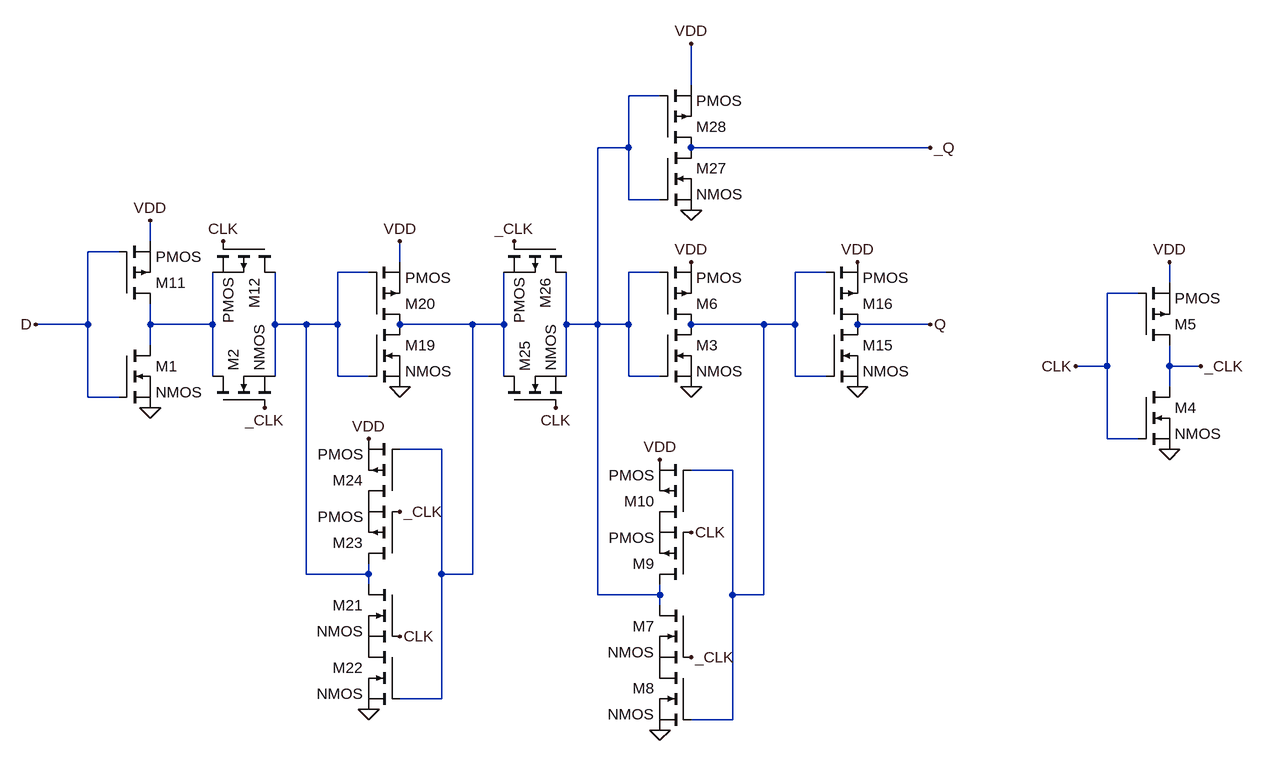
[diagram p0: schematic DFF.asc]
DFF.asc, the LTspice schematic file:
Version 4
SHEET 1 1504 1156
WIRE 656 -112 656 -176
WIRE 608 -96 560 -96
WIRE 560 -16 560 -96
WIRE 560 -16 512 -16
WIRE 1024 -16 656 -16
WIRE 560 64 560 -16
WIRE 608 64 560 64
WIRE -176 128 -176 96
WIRE -224 144 -272 144
WIRE 208 160 208 128
WIRE 160 176 112 176
WIRE 608 176 560 176
WIRE 864 176 816 176
WIRE 1392 192 1392 160
WIRE 1344 208 1296 208
WIRE -272 256 -272 144
WIRE -272 256 -352 256
WIRE -176 256 -176 224
WIRE -80 256 -80 176
WIRE -80 256 -176 256
WIRE 16 256 16 176
WIRE 64 256 16 256
WIRE 112 256 112 176
WIRE 112 256 64 256
WIRE 320 256 208 256
WIRE 368 256 368 176
WIRE 368 256 320 256
WIRE 464 256 464 176
WIRE 512 256 512 -16
WIRE 512 256 464 256
WIRE 560 256 560 176
WIRE 560 256 512 256
WIRE 768 256 656 256
WIRE 816 256 816 176
WIRE 816 256 768 256
WIRE 1024 256 912 256
WIRE -176 288 -176 256
WIRE 1296 320 1296 208
WIRE 1296 320 1248 320
WIRE 1392 320 1392 288
WIRE 1440 320 1392 320
WIRE -80 336 -80 256
WIRE 16 336 16 256
WIRE 112 336 112 256
WIRE 160 336 112 336
WIRE 368 336 368 256
WIRE 464 336 464 256
WIRE 560 336 560 256
WIRE 608 336 560 336
WIRE 816 336 816 256
WIRE 864 336 816 336
WIRE 1392 352 1392 320
WIRE -272 368 -272 256
WIRE -224 368 -272 368
WIRE 1296 432 1296 320
WIRE 1344 432 1296 432
WIRE 272 448 208 448
WIRE 720 480 656 480
WIRE 64 640 64 256
WIRE 160 640 160 624
WIRE 160 640 64 640
WIRE 272 640 272 448
WIRE 320 640 320 256
WIRE 320 640 272 640
WIRE 160 656 160 640
WIRE 512 672 512 256
WIRE 608 672 608 656
WIRE 608 672 512 672
WIRE 720 672 720 480
WIRE 768 672 768 256
WIRE 768 672 720 672
WIRE 608 688 608 672
WIRE 272 832 272 640
WIRE 272 832 208 832
WIRE 720 864 720 672
WIRE 720 864 656 864
FLAG -352 256 D
FLAG -176 384 0
FLAG 208 352 0
FLAG 160 848 0
FLAG 160 432 VDD
FLAG 656 80 0
FLAG 656 352 0
FLAG 608 880 0
FLAG 608 464 VDD
FLAG 912 352 0
FLAG -176 96 VDD
FLAG 208 128 VDD
FLAG 656 -176 VDD
FLAG 656 160 VDD
FLAG 912 160 VDD
FLAG -64 128 CLK
FLAG 448 384 CLK
FLAG 208 736 CLK
FLAG 656 768 _CLK
FLAG 0 384 _CLK
FLAG 384 128 _CLK
FLAG 208 544 _CLK
FLAG 656 576 CLK
FLAG 1024 -16 _Q
FLAG 1024 256 Q
FLAG 1392 448 0
FLAG 1392 160 VDD
FLAG 1248 320 CLK
FLAG 1440 320 _CLK
SYMBOL nmos -224 288 R0
SYMATTR InstName M1
SYMBOL nmos -80 384 R270
SYMATTR InstName M2
SYMBOL pmos -224 224 M180
SYMATTR InstName M11
SYMBOL pmos 16 128 R90
SYMATTR InstName M12
SYMBOL nmos 160 256 R0
SYMATTR InstName M19
SYMBOL pmos 160 256 M180
SYMATTR InstName M20
SYMBOL nmos 208 656 M0
SYMATTR InstName M21
SYMBOL nmos 208 752 M0
SYMATTR InstName M22
SYMBOL pmos 208 624 R180
SYMATTR InstName M23
SYMBOL pmos 208 528 R180
SYMATTR InstName M24
SYMBOL nmos 368 384 R270
SYMATTR InstName M25
SYMBOL pmos 464 128 R90
SYMATTR InstName M26
SYMBOL nmos 608 -16 R0
SYMATTR InstName M27
SYMBOL pmos 608 -16 M180
SYMATTR InstName M28
SYMBOL nmos 608 256 R0
SYMATTR InstName M3
SYMBOL pmos 608 256 M180
SYMATTR InstName M6
SYMBOL nmos 656 688 M0
SYMATTR InstName M7
SYMBOL nmos 656 784 M0
SYMATTR InstName M8
SYMBOL pmos 656 656 R180
SYMATTR InstName M9
SYMBOL pmos 656 560 R180
SYMATTR InstName M10
SYMBOL nmos 864 256 R0
SYMATTR InstName M15
SYMBOL pmos 864 256 M180
SYMATTR InstName M16
SYMBOL nmos 1344 352 R0
SYMATTR InstName M4
SYMBOL pmos 1344 288 M180
SYMATTR InstName M5

The netlist it stands for:
* DFF.asc
M1 N004 D 0 0 NMOS
M2 N004 _CLK N002 N002 NMOS
M11 N004 D VDD VDD PMOS
M12 N002 CLK N004 N004 PMOS
M19 N005 N002 0 0 NMOS
M20 N005 N002 VDD VDD PMOS
M21 N002 CLK P001 P001 NMOS
M22 P001 N005 0 0 NMOS
M23 N002 _CLK P002 P002 PMOS
M24 P002 N005 VDD VDD PMOS
M25 N005 CLK N001 N001 NMOS
M26 N001 _CLK N005 N005 PMOS
M27 _Q N001 0 0 NMOS
M28 _Q N001 VDD VDD PMOS
M3 N003 N001 0 0 NMOS
M6 N003 N001 VDD VDD PMOS
M7 N001 _CLK P003 P003 NMOS
M8 P003 N003 0 0 NMOS
M9 N001 CLK P004 P004 PMOS
M10 P004 N003 VDD VDD PMOS
M15 Q N003 0 0 NMOS
M16 Q N003 VDD VDD PMOS
M4 _CLK CLK 0 0 NMOS
M5 _CLK CLK VDD VDD PMOS
.model NMOS NMOS
.model PMOS PMOS
.lib standard.mos
.backanno
.end